# EAGLE design relays_board_4 (EAGLE 5.04)
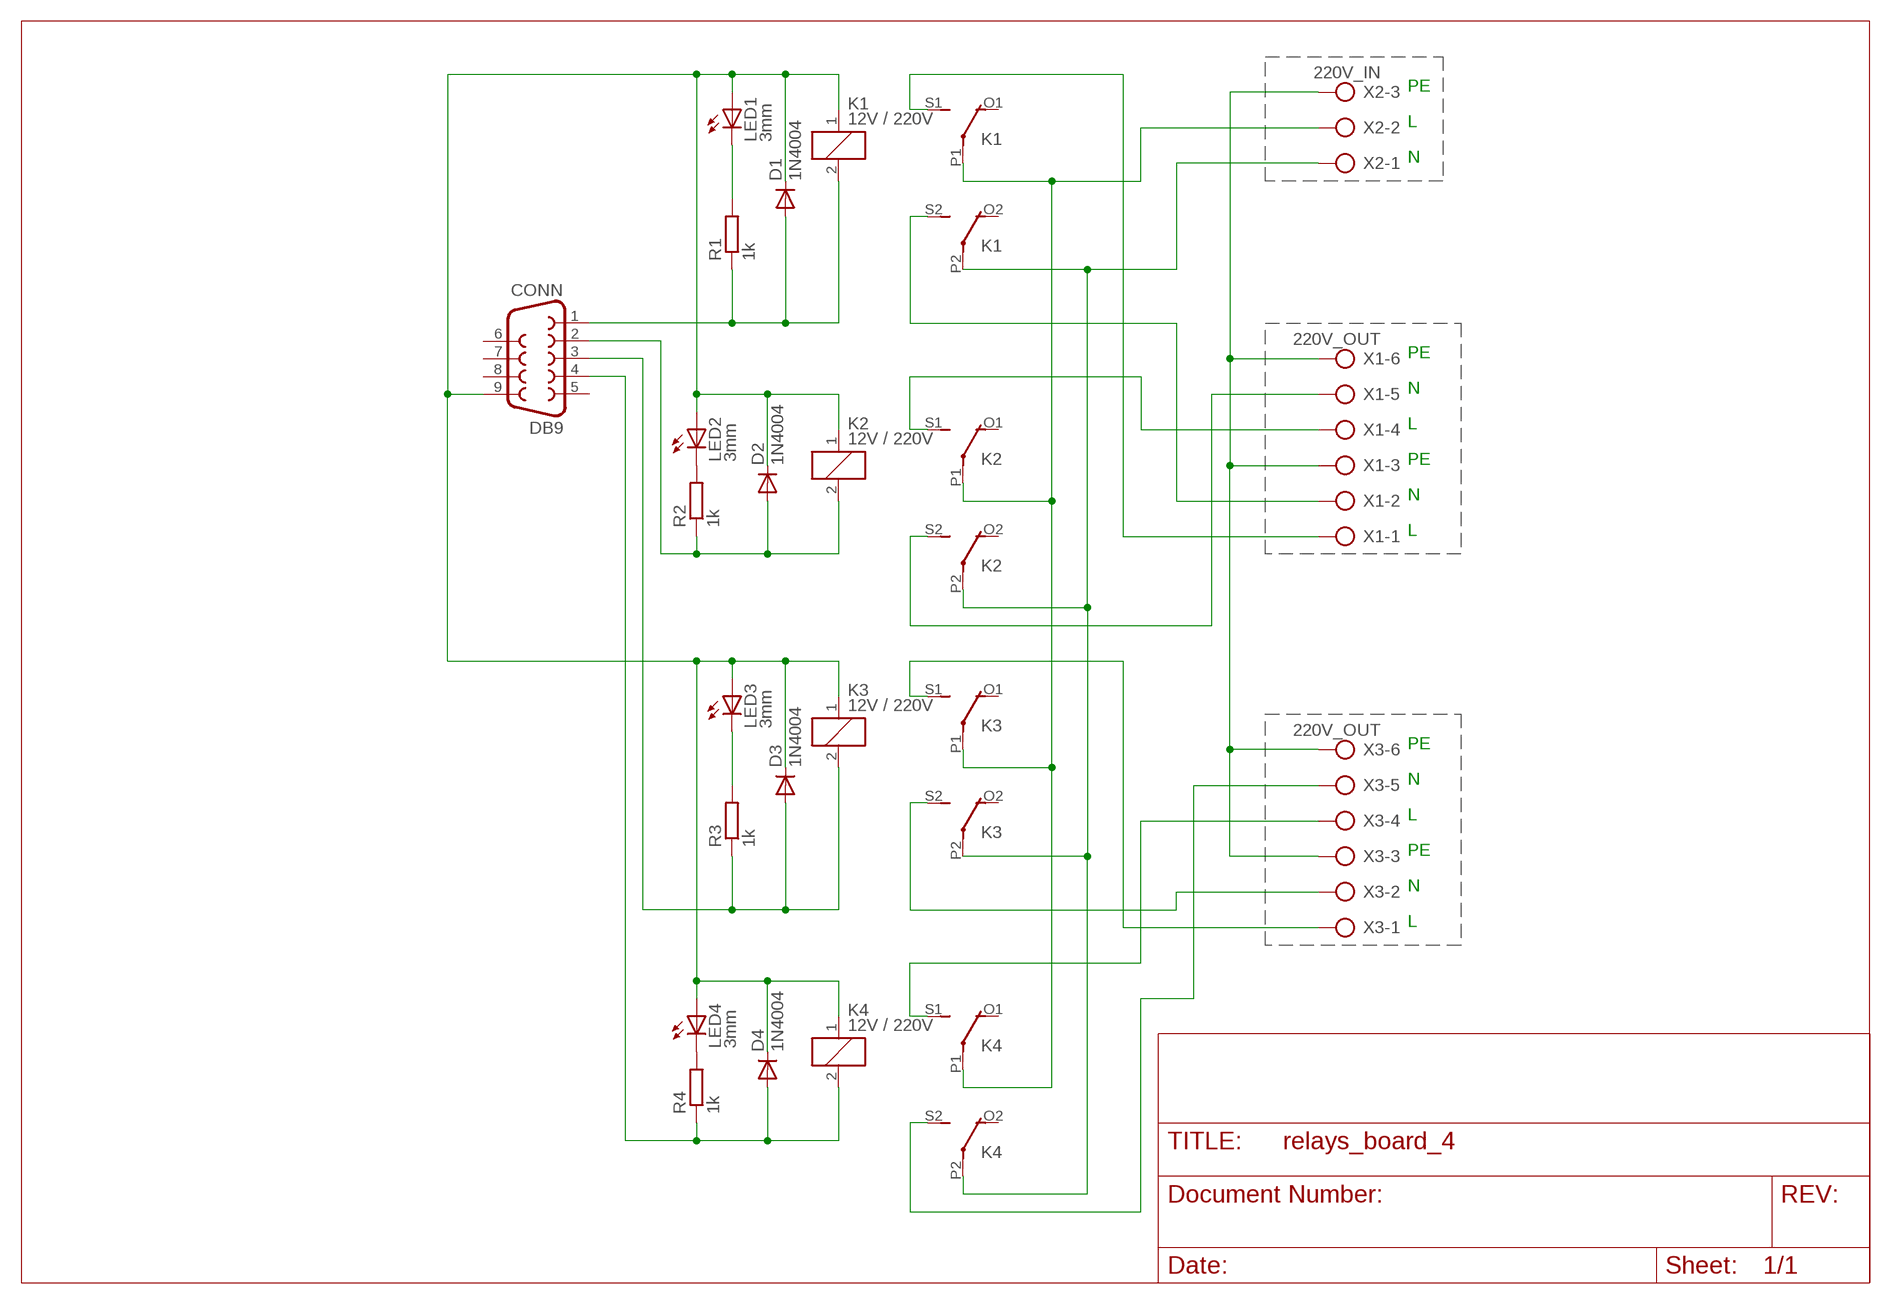
[diagram p0: schematic, sheet 1]

## Parts
CONN  DB9  F09H  [F09H]
D1  1N4004  [DO41-10]
D2  1N4004  [DO41-10]
D3  1N4004  [DO41-10]
D4  1N4004  [DO41-10]
K1  12V / 220V  4052  [F4052]
K2  12V / 220V  4052  [F4052]
K3  12V / 220V  4052  [F4052]
K4  12V / 220V  4052  [F4052]
LED1  3mm  LED3MM  [LED3MM]
LED2  3mm  LED3MM  [LED3MM]
LED3  3mm  LED3MM  [LED3MM]
LED4  3mm  LED3MM  [LED3MM]
R1  1k  R-EU_0207/2V  [0207/2V]
R2  1k  R-EU_0207/2V  [0207/2V]
R3  1k  R-EU_0207/2V  [0207/2V]
R4  1k  R-EU_0207/2V  [0207/2V]
X1  220V_OUT  AK500/6  [AK500/6]
X2  220V_IN  AK500/3  [AK500/3]
X3  220V_OUT  AK500/6  [AK500/6]

## Nets
N$2: K1.P2(3:P) K2.P2(3:P) K3.P2(3:P) K4.P2(3:P) X2.1
N$3: LED1.K(C) R1.2
N$4: LED2.K(C) R2.2
N$5: K1.S1(2:S) X1.1
N$6: X1.3 X1.6 X2.3 X3.3 X3.6
N$7: K1.S2(3:S) X1.2
N$8: CONN.9 D1.C D2.C D3.C D4.C K1.1 K2.1 K3.1 K4.1 LED1.A LED2.A LED3.A LED4.A
N$9: CONN.3 D3.A K3.2 R3.1
N$11: CONN.1 D1.A K1.2 R1.1
N$12: CONN.2 D2.A K2.2 R2.1
N$13: K2.S1(2:S) X1.4
N$14: K2.S2(3:S) X1.5
N$15: CONN.4 D4.A K4.2 R4.1
N$16: LED3.K(C) R3.2
N$17: LED4.K(C) R4.2
N$18: K1.P1(2:P) K2.P1(2:P) K3.P1(2:P) K4.P1(2:P) X2.2
N$20: K3.S1(2:S) X3.1
N$21: K3.S2(3:S) X3.2
N$22: K4.S1(2:S) X3.4
N$23: K4.S2(3:S) X3.5
Unconnected: CONN.5 CONN.6 CONN.7 CONN.8 K1.O1(2:O) K1.O2(3:O) K2.O1(2:O) K2.O2(3:O) K3.O1(2:O) K3.O2(3:O) K4.O1(2:O) K4.O2(3:O)

## Notes on the sheet
- PE
- L
- N
- PE
- N
- L
- PE
- N
- L
- PE
- N
- L
- PE
- N
- L

## Library data of the parts
CONN = con-subd:F09: SUB-D
D1-D4 = diode:1N4004: DIODE general purpose rectifier, 1 A
K1-K4 = relay:4052: RELAY 2 x switch, Finder
LED1-LED4 = led:LED: LED OSRAM: - CHIPLED LG R971, LG N971, LY N971, LG Q971, LY Q971, LO R971, LY R971 LH N974, LH R974 LS Q976, LO Q976, LY Q976 LO Q996 - Hyper CHIPLED LW Q18S LB Q993, LB Q99A, LB R99A - SideLED LS A670, LO A670, LY A670, LG A670, LP A670 LB A673, LV A673, LT A673, LW A673 LH A674 LY A675 LS A676, LA A676, LO A676, LY A676, LW A676 LS A679, LY A679, LG A679 - Hyper Micro SIDELED® LS Y876, LA Y876, LO Y876, LY Y876 LT Y87S - SmartLED LW L88C, LW L88S LB L89C, LB L89S, LG L890 LS L89K, LO L89K, LY L89K LS L896, LA L896, LO L896, LY L896 - TOPLED LS T670, LO T670, LY T670, LG T670, LP T670 LSG T670, LSP T670, LSY T670, LOP T670, LYG T670 LG T671, LOG T671, LSG T671 LB T673, LV T673, LT T673, LW T673 LH T674 LS T676, LA T676, LO T676, LY T676, LB T676, LH T676, LSB T676, LW T676 LB T67C, LV T67C, LT T67C, LS T67K, LO T67K, LY T67K, LW E67C LS E67B, LA E67B, LO E67B, LY E67B, LB E67C, LV E67C, LT E67C LW T67C LS T679, LY T679, LG T679 LS T770, LO T770, LY T770, LG T770, LP T770 LB T773, LV T773, LT T773, LW T773 LH T774 LS E675, LA E675, LY E675, LS T675 LS T776, LA T776, LO T776, LY T776, LB T776 LHGB T686 LT T68C, LB T68C - Hyper Mini TOPLED® LB M676 - Mini TOPLED Santana® LG M470 LS M47K, LO M47K, LY M47K Source: http://www.osram.convergy.de LUXEON: - LUMILED® LXK2-PW12-R00, LXK2-PW12-S00, LXK2-PW14-U00, LXK2-PW14-V00 LXK2-PM12-R00, LXK2-PM12-S00, LXK2-PM14-U00 LXK2-PE12-Q00, LXK2-PE12-R00, LXK2-PE12-S00, LXK2-PE14-T00, LXK2-PE14-U00 LXK2-PB12-K00, LXK2-PB12-L00, LXK2-PB12-M00, LXK2-PB14-N00, LXK2-PB14-P00, LXK2-PB14-Q00 LXK2-PR12-L00, LXK2-PR12-M00, LXK2-PR14-Q00, LXK2-PR14-R00 LXK2-PD12-Q00, LXK2-PD12-R00, LXK2-PD12-S00 LXK2-PH12-R00, LXK2-PH12-S00 LXK2-PL12-P00, LXK2-PL12-Q00, LXK2-PL12-R00 Source: www.luxeon.com KINGBRIGHT: KA-3528ASYC Source: www.kingbright.com
R1-R4 = rcl:R-EU_: RESISTOR, European symbol
X1 X3 = con-ptr500:AK500/6: CONNECTOR
X2 = con-ptr500:AK500/3: CONNECTOR

## Board
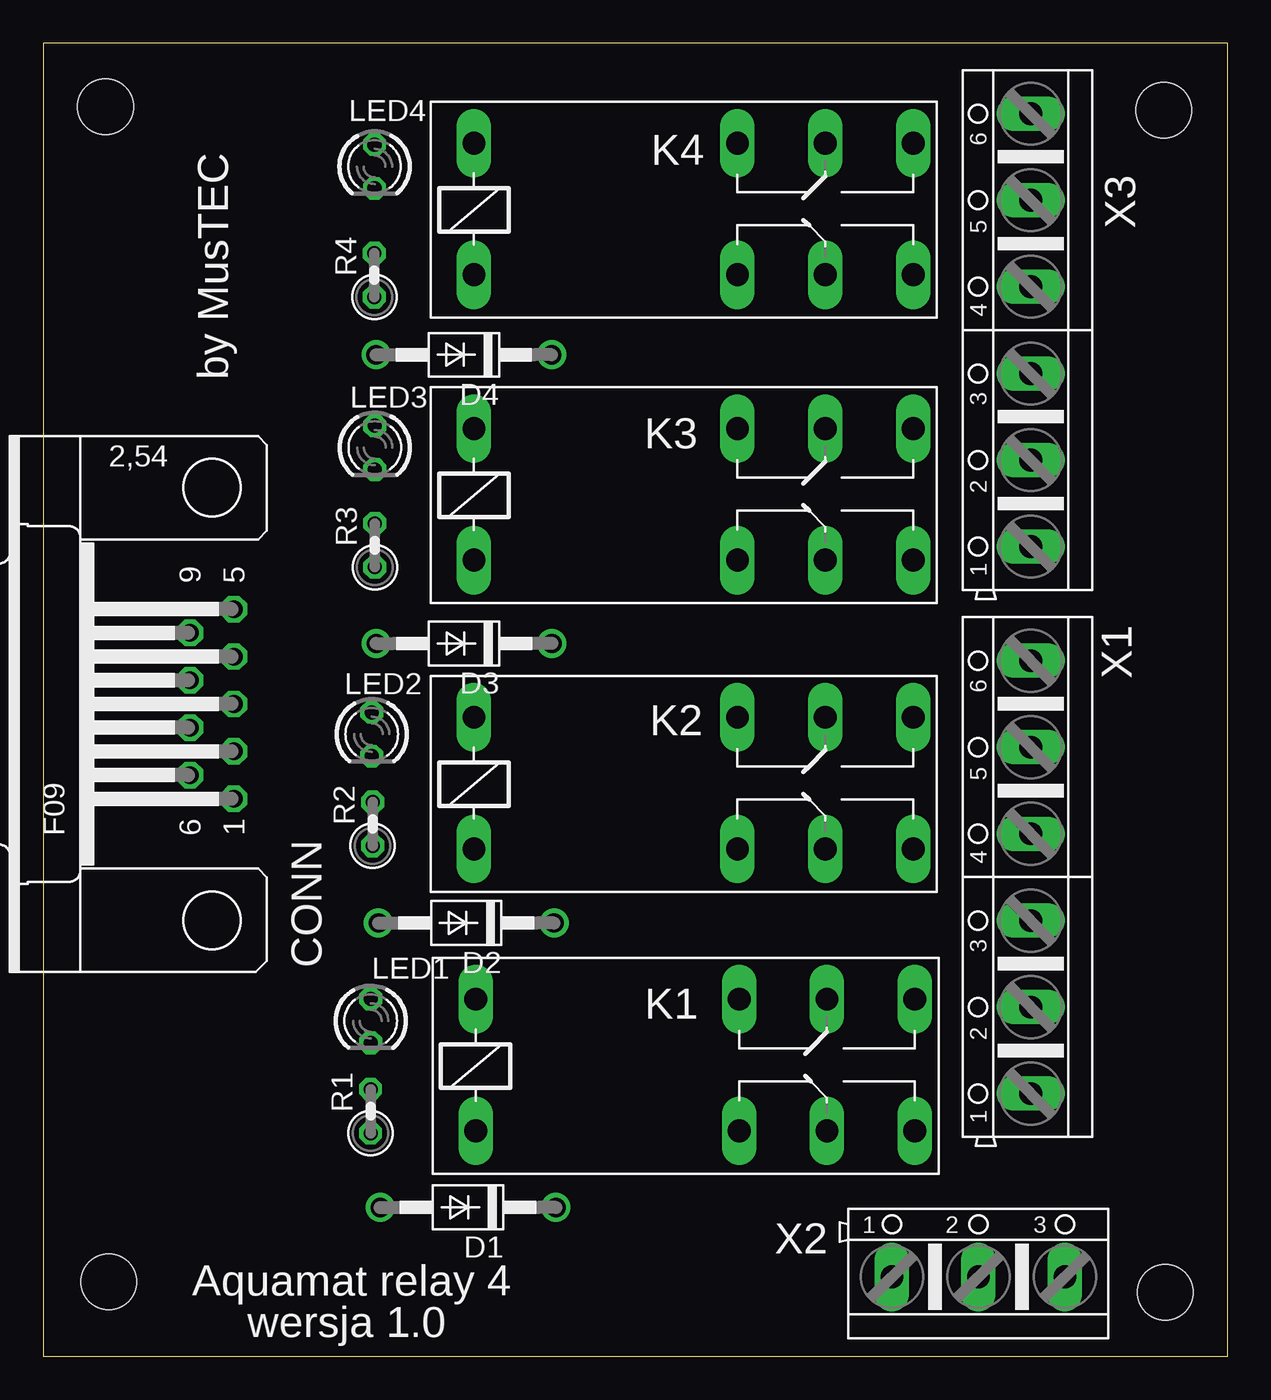
[diagram p1: board, top side]
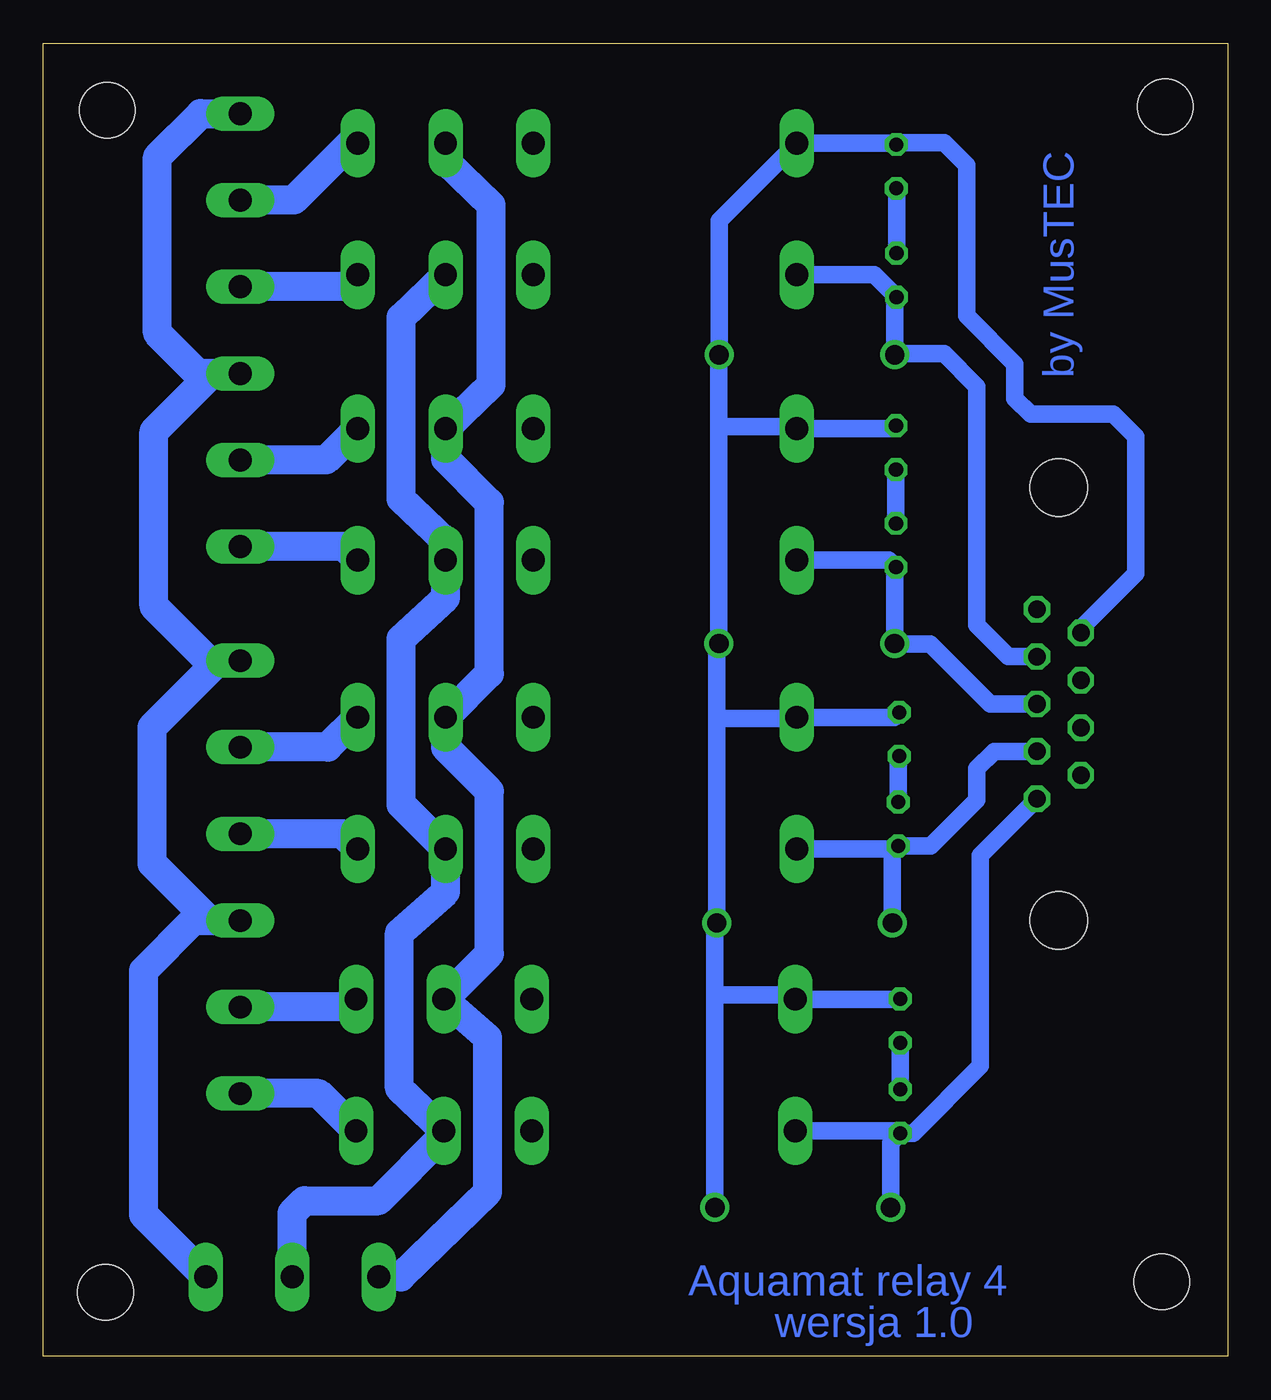
[diagram p2: board, bottom side, seen from below]

Size 68.5 x 75.97 mm. Coordinates in mm from the lower left corner, seen from the top.
Outline: 0,0 68.5,0 68.5,75.97 0,75.97 0,0
Copper layers (1*16): Top 0.035mm / dielectric 1.5mm / Bottom 0.035mm
Design rules "default": minimum track width 10mil, minimum drill 24mil, track to track 8mil, track to pad 8mil, pad to pad 8mil, via to via 8mil, smd to smd 8mil, copper to edge 40mil, drill to drill 8mil, minimum pad ring 10mil, minimum via ring 8mil, stop-mask expansion 4mil, vias tented up to drill 0mil, thermal gap 10mil
Holes 3.2 mm at 3.6,72.3 3.8,4.3 64.8,72.1 64.9,3.7

### Footprints (pad centres in the part's own frame; a part is rotated, then mirrored left to right if it is on the bottom)
F09H = drill 1.016 octagon: 1 -5.486,-1.27; 2 -2.743,-1.27; 3 0,-1.27; 4 2.743,-1.27; 5 5.486,-1.27; 6 -4.115,1.27; 7 -1.372,1.27; 8 1.372,1.27; 9 4.115,1.27 | hole 3.302: -12.522,0; 12.522,0
DO41-10 = drill 1.118 round: A 5.08,0; C -5.08,0
F4052 = drill 1.321 long: 1 -3.81,3.81; 2 -3.81,-3.81; O1 11.43,-3.81; O2 11.43,3.81; P1 16.51,-3.81; P2 16.51,3.81; S1 21.59,-3.81; S2 21.59,3.81
LED3MM = drill 0.813 octagon: A -1.27,0; K 1.27,0
0207/2V = drill 0.813 octagon: 1 -1.27,0; 2 1.27,0
AK500/6 = drill 1.321 long: 1 -12.522,0; 2 -7.518,0; 3 -2.515,0; 4 2.515,0; 5 7.518,0; 6 12.522,0
AK500/3 = drill 1.321 long: 1 -5.004,0; 2 0,0; 3 5.004,0

### Placement (x,y rotation side)
CONN  9.76,37.74 90 top
D1  24.57,8.61 180 top
D2  24.47,25.07 180 top
D3  24.34,41.24 180 top
D4  24.33,57.94 180 top
K1  28.82,16.85 0 top
K2  28.72,33.16 0 top
K3  28.72,49.87 0 top
K4  28.72,66.38 0 top
LED1  18.94,19.41 270 top
LED2  19,35.99 270 top
LED3  19.18,52.57 270 top
LED4  19.16,68.84 270 top
R1  18.93,14.18 90 top
R2  19.05,30.8 90 top
R3  19.18,46.92 90 top
R4  19.15,62.55 90 top
X1  57.11,27.72 90 top
X2  54.09,4.59 0 top
X3  57.11,59.37 90 top

### Tracks (layer width: path | path; a pad name or v marks a point on that pad's centre or on a via)
N$2
  Bottom 1.676: K4.P2 45.23,69.13 42.6,66.6 42.6,56.21 K3.P2 45.23,51.93 42.7,49.4 42.7,39.5 K2.P2 45.23,35.23 42.7,32.7 42.7,23.29 K1.P2 42.8,18.43 42.8,9.5 47.81,4.59 X2.1
N$3
  Bottom 1.016: LED1.K R1.2
N$4
  Bottom 1.016: LED2.K 19.05,34.67 R2.2
N$5
  Bottom 1.676: K1.S1 52.57,15.2 X1.1
N$6
  Bottom 1.676: X2.3 62.7,8.2 62.7,22.3 59.8,25.2 X1.3 58.91,25.2 62.2,28.5 62.2,36.4 58.4,40.2 57.15,40.2 X1.6 58.94,40.24 62.1,43.4 62.1,53.5 58.8,56.8 57.16,56.8 X3.3 59.55,56.85 61.9,59.2 61.9,69.4 59.4,71.9 X3.6
N$7
  Bottom 1.676: K1.S2 50.87,20.2 X1.2
N$8
  Bottom 1.016: LED3.A 19.34,53.68 K3.1 25.03,53.8 29.42,53.8 | LED2.A 19.29,36.97 K2.1 24.98,36.9 29.55,36.9 | LED1.A 18.96,20.66 K1.1 25.25,20.9 29.65,20.9 | 29.42,53.8 D3.C 29.55,41.11 29.55,36.9 | 29.42,53.8 D4.C 29.41,65.69 K4.1 19.24,70.19 LED4.A 19.07,70.2 16.4,70.2 15.1,68.9 15.1,60.2 12.3,57.4 12.3,55.4 11.4,54.5 6.6,54.5 5.3,53.2 5.3,45.3 8.49,42.11 CONN.9 | 29.55,36.9 D2.C 29.65,24.97 29.65,20.9 | D1.C 29.65,20.9
N$9
  Bottom 1.016: K3.2 19.59,46.06 R3.1 19.26,45.57 D3.A 19.22,41.2 17.2,41.2 13.74,37.74 CONN.3
N$11
  Bottom 1.016: R1.1 19.06,13.04 K1.2 | R1.1 19.49,12.35 D1.A | R1.1 18.19,12.91 14.3,16.8 14.3,28.98 CONN.1
N$12
  Bottom 1.016: R2.1 19.23,29.35 K2.2 | R2.1 19.39,29.19 D2.A | R2.1 17.17,29.53 14.5,32.2 14.5,34 13.5,35 CONN.2
N$13
  Bottom 1.676: K2.S1 51.2,30.23 X1.4
N$14
  Bottom 1.676: K2.S2 52.04,35.24 X1.5
N$15
  Bottom 1.016: K4.2 20.44,62.57 R4.1 19.25,61.18 D4.A 19.19,58 16.4,58 14.5,56.1 14.5,42.3 12.68,40.48 CONN.4
N$16
  Bottom 1.016: R3.2 LED3.K
N$17
  Bottom 1.016: LED4.K R4.2
N$18
  Bottom 1.676: K4.P1 47.8,60.1 47.8,49.6 45.23,47.13 K3.P1 45.23,43.87 47.8,41.5 47.8,31.92 K2.P1 45.23,26.87 47.9,24.5 47.9,15.51 K1.P1 45.33,12.77 49.1,9 53.4,9 54.1,8.3 X2.2
N$20
  Bottom 1.676: K3.S1 51.1,46.85 X3.1
N$21
  Bottom 1.676: K3.S2 52.14,51.85 X3.2
N$22
  Bottom 1.676: K4.S1 50.99,61.88 X3.4
N$23
  Bottom 1.676: K4.S2 50.71,70.19 54,66.9 57.1,66.9 X3.5

### Text on the board
Bottom: by MusTEC | Aquamat relay 4 | wersja 1.0
tPlace: by MusTEC | Aquamat relay 4 | wersja 1.0